# Altium schematic sheet door_lock_controller.SchDoc
size 203 x 127 mm
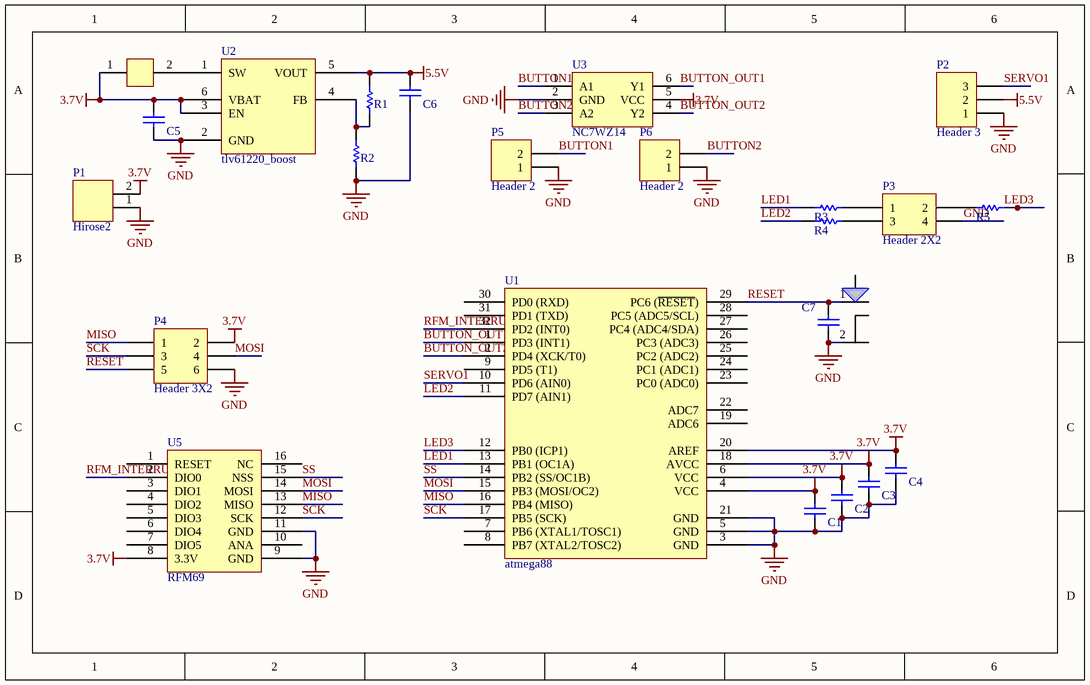
[diagram p0: door_lock_controller.SchDoc]

## Parts
C1  CAP 100nF 10V 0603(1608)  [CAPC0603(1608)100_N]  (value not drawn)
C2  CAP 100nF 10V 0603(1608)  [CAPC0603(1608)100_N]  (value not drawn)
C3  CAP 100nF 10V 0603(1608)  [CAPC0603(1608)100_N]  (value not drawn)
C4  CAP 100nF 10V 0603(1608)  [CAPC0603(1608)100_N]  (value not drawn)
C5  CAP 10uF 10V 0603(1608)  [CAPC0603(1608)100_N]  (value not drawn)
C6  CAP 10uF 10V 0603(1608)  [CAPC0603(1608)100_N]  (value not drawn)
C7  CAP 10nF 10V 0603(1608)  [CAPC0603(1608)100_M]  (value not drawn)
L1  TYS6045_inductor  [TYS6045]  (value not drawn)
P1  Hirose2  [DF3A-2P-2DS]
P2  Header 3  [HDR1X3]
P3  Header 2X2  [HDR2X2]
P4  Header 3X2  [HDR2X3]
P5  Header 2  [HDR1X2]
P6  Header 2  [HDR1X2]
R1  1M8 5% 0603(1608)  [RESC0603(1608)_L]  (value not drawn)
R2  180K 5% 0603(1608)  [RESC0603(1608)_L]  (value not drawn)
R3  180R 5% 0603(1608)  [RESC0603(1608)_L]  (value not drawn)
R4  180R 5% 0603(1608)  [RESC0603(1608)_L]  (value not drawn)
R5  180R 5% 0603(1608)  [RESC0603(1608)_L]  (value not drawn)
S1  2lead_low_profile_switch  [2lead_low_profile_switch]  (value not drawn)
U1  atmega88  [atmega44/88/168]
U2  tlv61220_boost  [TLV61220_BOOST]
U3  NC7WZ14  [NC7WZ14]
U5  RFM69  [RFM69]

## Nets
3.7V: C1.2 C2.2 C3.2 C4.2 C5.2 L1.1 P1.2 P4.2 U1.4(VCC) U1.6(VCC) U1.18(AVCC) U1.20(AREF) U2.3(EN) U2.6(VBAT) U3.5(VCC) U5.8(3.3V)
5.5V: C6.2 P2.2 R1.2 U2.5(VOUT)
GND: C1.1 C2.1 C3.1 C4.1 C5.1 C6.1 C7.1 P1.1 P2.1 P3.4 P4.6 P5.1 P6.1 R2.1 S1.2(GND) U1.3(GND) U1.5(GND) U1.21(GND) U2.2(GND) U3.2(GND) U5.9(GND) U5.11(GND)
BUTTON1: P5.2 U3.1(A1)
BUTTON2: P6.2 U3.3(A2)
BUTTON_OUT1: U1.1(PD3_(INT1)) U3.6(Y1)
BUTTON_OUT2: U1.2(PD4_(XCK/T0)) U3.4(Y2)
LED1: R3.1 U1.13(PB1_(OC1A))
LED2: R4.1 U1.11(PD7_(AIN1))
LED3: R5.2 U1.12(PB0_(ICP1))
MISO: P4.1 U1.16(PB4_(MISO)) U5.13(MISO)
MOSI: P4.4 U1.15(PB3_(MOSI/OC2)) U5.14(MOSI)
RESET: C7.2 P4.5 S1.1(GND) U1.29(PC6_(~{RESET}))
RFM_INTERRUPT: U1.32(PD2_(INT0)) U5.2(DIO0)
SCK: P4.3 U1.17(PB5_(SCK)) U5.12(SCK)
SERVO1: P2.3 U1.10(PD6_(AIN0))
SS: U1.14(PB2_(SS/OC1B)) U5.15(NSS)
NetL1_2: L1.2 U2.1(SW)
NetP3_1: P3.1 R3.2
NetP3_2: P3.2 R5.1
NetP3_3: P3.3 R4.2
NetR1_1: R1.1 R2.2 U2.4(FB)

Not connected (* = marked no-connect by the designer): U1 7(PB6_(XTAL1/TOSC1)) 8(PB7_(XTAL2/TOSC2)) 9(PD5_(T1)) 19(ADC6) 22(ADC7) 23(PC0_(ADC0)) 24(PC1_(ADC1)) 25(PC2_(ADC2)) 26(PC3_(ADC3)) 27(PC4_(ADC4/SDA)) 28(PC5_(ADC5/SCL)) 30(PD0_(RXD)) 31(PD1_(TXD)); U5 1(RESET) 3(DIO1) 4(DIO2) 5(DIO3) 6(DIO4) 7(DIO5) 10(ANA) 16(NC)

## Library data of the parts
C1-C4 = CMP-1035-02581-1: CAP 100nF 10V ±20% 0603 (1608 Metric) Thickness 1mm SMD; Case-Metric: 1608; Case-EIA: 0603; Max Thickness: 1 mm; Tolerance: ±20%; Rated Voltage: 10 V; Technology: SMT; Value: 100nF
C5 C6 = CMP-1035-02799-1: CAP 10uF 10V ±10% 0603 (1608 Metric) Thickness 1mm SMD; Case-Metric: 1608; Case-EIA: 0603; Max Thickness: 1 mm; Tolerance: ±10%; Technology: SMT; Rated Voltage: 10 V; Value: 10uF
C7 = CMP-1035-02304-1: CAP 10nF 10V ±2% 0603 (1608 Metric) Thickness 1mm SMD; Case-EIA: 0603; Case-Metric: 1608; Technology: SMT; Tolerance: ±2%; Rated Voltage: 10 V; Value: 10nF; Max Thickness: 1 mm
P2 = Header 3: Header, 3-Pin; LatestRevisionDate: 17-Jul-2002; LatestRevisionNote: Re-released for DXP Platform.; Publisher: Altium Limited
P3 = Header 2X2: Header, 2-Pin, Dual row; LatestRevisionDate: 17-Jul-2002; LatestRevisionNote: Re-released for DXP Platform.; Publisher: Altium Limited
P4 = Header 3X2: Header, 3-Pin, Dual row; LatestRevisionDate: 17-Jul-2002; LatestRevisionNote: Re-released for DXP Platform.; Publisher: Altium Limited
P5 P6 = Header 2: Header, 2-Pin; LatestRevisionDate: 17-Jul-2002; LatestRevisionNote: Re-released for DXP Platform.; Publisher: Altium Limited
R1 = CMP-1012-00152-1: 1M8 0.1W 5% 0603 (1608 Metric)  SMD; Value: 1800000.00 Ohm; Case-Metric: 1608; Case-EIA: 0603; Technology: SMT; Tolerance: 5 %; Power: 0.1 W
R2 = CMP-1012-00128-1: 180K 0.1W 5% 0603 (1608 Metric)  SMD; Case-Metric: 1608; Case-EIA: 0603; Value: 180000.00 Ohm; Technology: SMT; Power: 0.1 W; Tolerance: 5 %
R3-R5 = CMP-1012-00056-1: 180R 0.1W 5% 0603 (1608 Metric)  SMD; Value: 180.00 Ohm; Case-EIA: 0603; Case-Metric: 1608; Power: 0.1 W; Technology: SMT; Tolerance: 5 %